# EAGLE schematic alarmapp-schematic (EAGLE 8.7.1)
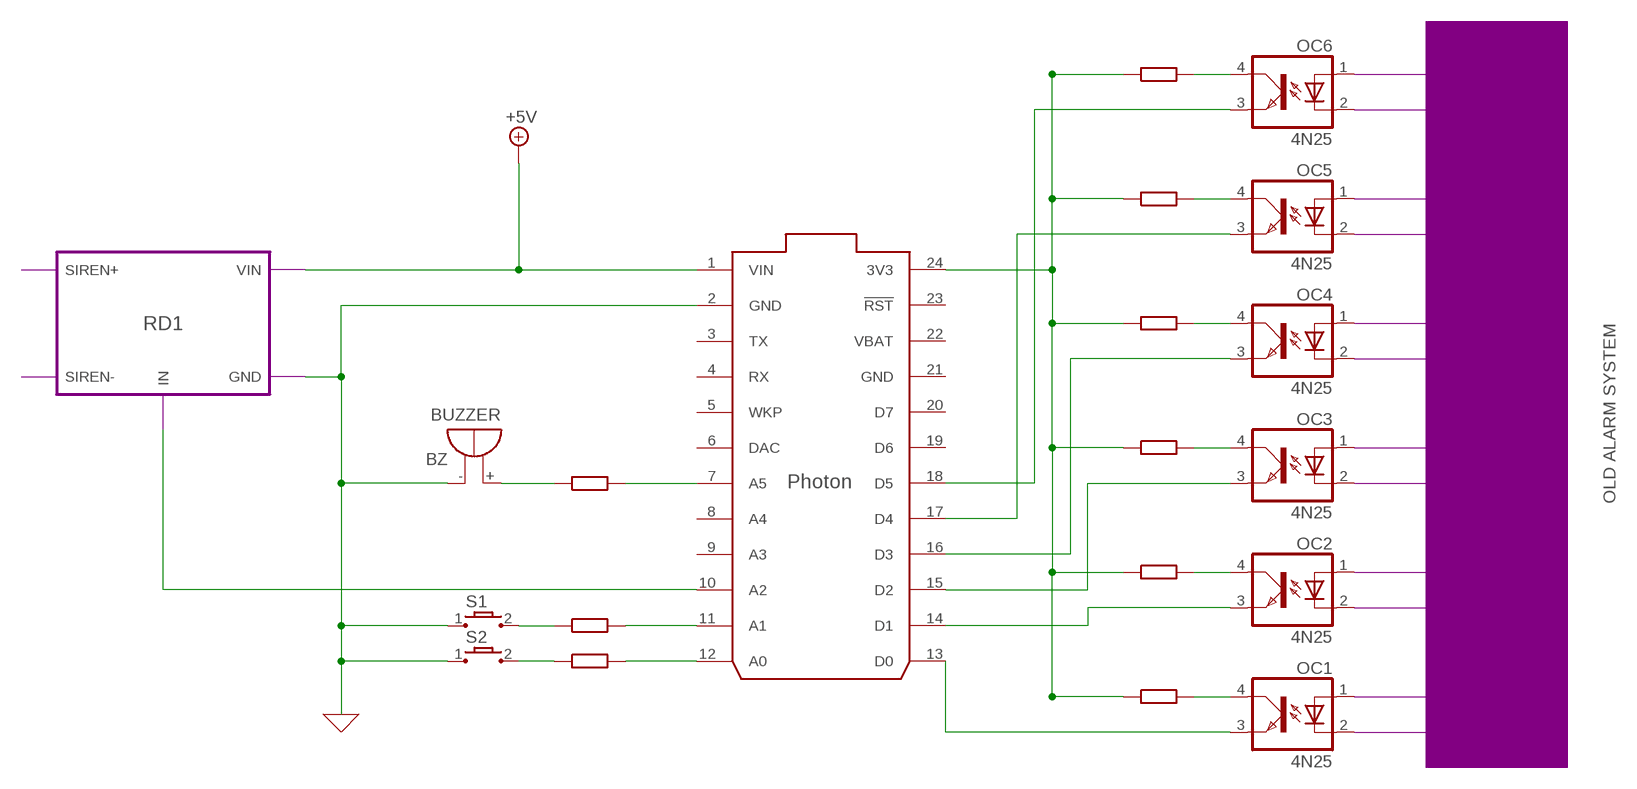
[diagram p0: schematic, sheet 1]

## Parts
BUZZER  BZ  EB2209A  [EB2209A]
OC1  4N25  SFH618A-2  [DIP4]
OC2  4N25  SFH618A-2  [DIP4]
OC3  4N25  SFH618A-2  [DIP4]
OC4  4N25  SFH618A-2  [DIP4]
OC5  4N25  SFH618A-2  [DIP4]
OC6  4N25  SFH618A-2  [DIP4]
S1  TL3302-G  [TL3302_GULL_WING]
S2  TL3302-G  [TL3302_GULL_WING]
U$1  PHOTON_SMD  [PHOTON_SMD]

## Module instances
RD1 = RELAY_DRIVER

## Nets
0: BUZZER.- S1.1 S2.1 U$1.2(GND) ; port RD1.GND ; supply symbol labelled GND
+5V: U$1.1(VIN) ; port RD1.VIN
N$1: OC6.4(COL)
N$2: OC5.4(COL)
N$3: OC4.4(COL)
N$4: OC3.4(COL)
N$5: OC2.4(COL)
N$6: OC1.4(COL)
N$7: U$1.24(3V3)
N$8: OC1.3(EMIT) U$1.13(D0)
N$9: OC6.3(EMIT) U$1.18(D5)
N$10: OC5.3(EMIT) U$1.17(D4)
N$11: OC4.3(EMIT) U$1.16(D3)
N$12: OC3.3(EMIT) U$1.15(D2)
N$13: U$1.12(A0)
N$14: U$1.11(A1)
N$15: S1.2
N$16: S2.2
N$17: BUZZER.+
N$18: U$1.7(A5)
N$19: OC2.3(EMIT) U$1.14(D1)
N$20: U$1.10(A2) ; port RD1.IN
Unconnected: OC1.1(A) OC1.2(C) OC2.1(A) OC2.2(C) OC3.1(A) OC3.2(C) OC4.1(A) OC4.2(C) OC5.1(A) OC5.2(C) OC6.1(A) OC6.2(C) U$1.3(TX) U$1.4(RX) U$1.5(WKP) U$1.6(DAC) U$1.8(A4) U$1.9(A3) U$1.19(D6) U$1.20(D7) U$1.23(!RST) U$1.25(EN) U$1.26(!SETUP) U$1.27(RGB_RED) U$1.28(RGB_GREEN) U$1.29(RGB_BLUE) U$1.30(USB_D-) U$1.31(USB_D+)

## Notes on the sheet
- OLD ALARM SYSTEM

## Power pins joined to a net without a drawn wire
GND: U$1.21(GND)
VBAT: U$1.22(VBAT)

## Library data of the parts
BUZZER = buzzer:EB2209A: BUZZER Source: Buerklin; OC_FARNELL: unknown; OC_NEWARK: unknown
OC1-OC6 = optocoupler:SFH618?*: Optocoupler, Phototransistor Output, Low Input Current Source: Data sheet <http://www.vishay.com/docs/83673/sfh618.pdf>; MF: VISHAY/TELEFUNKEN; MPN: SFH618A-2; OC_FARNELL: 6424855; OC_NEWARK: 21H7744
S1 S2 = eswitch-tact:TL3302: E-Switch TL3302 Series Tactile Switch Surface mount button commonly used for reset or general input. 3.5 x 6mm packaged design. -G: Gull wing termination. Parts TL-3302-x-xxxx-x-G -J: J-Lead termination. Parts TL-3302-x-xxxx-x-J Source: http://www.e-switch.com/Portals/0/Series_Pdf/TL3302.pdf Supplier: DigiKey: http://be.digikey.com/scripts/dksearch/dksus.dll?vendor=0&keywords=TL3302
U$1 = Spark:PHOTON_SMD: Photon (without headers) - designed to be surface mounted with 7 extra exposed pads on the bottom of the board which include, 3 RGB LED outputs, /SETUP, EN (3.3V SMPS enable input), USB D+ and USB D-.

## Module RELAY_DRIVER
Ports: VIN(io) GND(io) IN(io) SIREN+(io) SIREN-(io)

### Library data of the parts